# Altium project PCB_Project.PrjPcb (part 2 of 2)

## Sheet PART7_op_amp.SchDoc
size A4
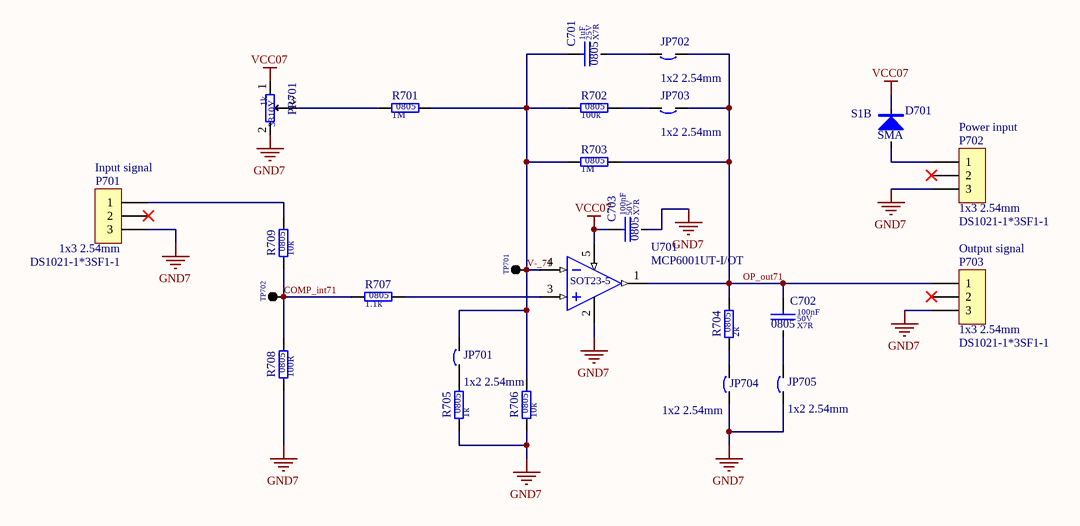
[diagram p7: PART7_op_amp.SchDoc]

### Parts
C701  value 1uF  Dielectric: X7R  Voltage: 25V  SCH_Footprint: 0805  [C_0805_2012]  (hidden comment: Ceramic X7R)
C702  value 100nF  Dielectric: X7R  Voltage: 50V  SCH_Footprint: 0805  [C_0805_2012]  (hidden comment: Ceramic X7R)
C703  value 100nF  Dielectric: X7R  Voltage: 50V  SCH_Footprint: 0805  [C_0805_2012]  (hidden comment: Ceramic X7R)
D701  value S1B  SCH_Footprint: SMA  [SMA_DO-214AC]
JP701  SCH_Footprint: 1x2 2.54mm  [P_HEADER_1x2_2.54]  (hidden comment: Goldpin)
JP702  SCH_Footprint: 1x2 2.54mm  [P_HEADER_1x2_2.54]  (hidden comment: Goldpin)
JP703  SCH_Footprint: 1x2 2.54mm  [P_HEADER_1x2_2.54]  (hidden comment: Goldpin)
JP704  SCH_Footprint: 1x2 2.54mm  [P_HEADER_1x2_2.54]  (hidden comment: Goldpin)
JP705  SCH_Footprint: 1x2 2.54mm  [P_HEADER_1x2_2.54]  (hidden comment: Goldpin)
P701  Input signal  value DS1021-1*3SF1-1  SCH_Footprint: 1x3 2.54mm  [P_HEADER_1x3_2.54]
P702  Power input  value DS1021-1*3SF1-1  SCH_Footprint: 1x3 2.54mm  [P_HEADER_1x3_2.54]
P703  Output signal  value DS1021-1*3SF1-1  SCH_Footprint: 1x3 2.54mm  [P_HEADER_1x3_2.54]
PR701  value 1k  [3310Y]  (hidden comment: Resistor)
R701  value 1M  SCH_Footprint: 0805  [R_0805_2012]  (hidden comment: Resistor)
R702  value 100k  SCH_Footprint: 0805  [R_0805_2012]  (hidden comment: Resistor)
R703  value 1M  SCH_Footprint: 0805  [R_0805_2012]  (hidden comment: Resistor)
R704  value 2k  SCH_Footprint: 0805  [R_0805_2012]  (hidden comment: Resistor)
R705  value 1k  SCH_Footprint: 0805  [R_0805_2012]  (hidden comment: Resistor)
R706  value 10k  SCH_Footprint: 0805  [R_0805_2012]  (hidden comment: Resistor)
R707  value 1.1k  SCH_Footprint: 0805  [R_0805_2012]  (hidden comment: Resistor)
R708  value 100R  SCH_Footprint: 0805  [R_0805_2012]  (hidden comment: Resistor)
R709  value 10k  SCH_Footprint: 0805  [R_0805_2012]  (hidden comment: Resistor)
TP701  Single pin  [TP_1PIN]  (value not drawn)
TP702  Single pin  [TP_1PIN]  (value not drawn)
U701  value MCP6001UT-I/OT  SCH_Footprint: SOT23-5  [SOT23-5_SC74A_SOT753_M]  (hidden comment: MCP6001UT-IOT)

### Nets
GND7: C703.2 JP704.1 JP705.1 P701.3 P702.3 P703.3 PR701.2 R705.1 R706.1 R708.1 U701.2(GND)
VCC07: C703.1 D701.1 PR701.1 U701.5(VDD)
COMP_int71: R707.1 R708.2 R709.1 TP702.1(TP)
OP_out71: C702.1 JP702.1 JP703.1 P703.1 R703.2 R704.2 U701.1(OUT)
V-_71: C701.1 JP701.2 R701.2 R702.1 R703.1 R706.2 TP701.1(TP) U701.4(IN-)
NetC701_2: C701.2 JP702.2
NetC702_2: C702.2 JP705.2
NetD701_2: D701.2 P702.1
NetJP701_1: JP701.1 R705.2
NetJP703_2: JP703.2 R702.2
NetJP704_2: JP704.2 R704.1
NetP701_1: P701.1 R709.2
NetPR701_3: PR701.3 R701.1
NetR707_2: R707.2 U701.3(IN+)

Not connected (* = marked no-connect by the designer): P701 2*; P702 2*; P703 2*

### Library data of the parts
C701 = C_1uF_25V_X7R_0805_10: Capacitor; Manufacturer: AVX; Manufacturer Part Number: 08053C105KAT2A; Tolerance (%): 10; Part Number: C_1uF_25V_X7R_0805_10; HelpURL: https://www.tme.eu/Document/667fe6e7748c0ed1675574c6bf64b751/AVX_X7R.pdf; Supplier 1: TME; Supplier Part Number 1: 08053C105KAT2A; Supplier 2: RS Components; Supplier Part Number 2: 1351396; Supplier 3: Farnell; Supplier Part Number 3: 1658877; Supplier 4: Mouser; Supplier Part Number 4: 581-08053C105KAT2A; Supplier 5: Digi-Key; Supplier Part Number 5: 478-5030-1-ND
C702 C703 = C_100nF_50V_X7R_0805_10: Capacitor; Manufacturer: AVX; Manufacturer Part Number: 08055C104K4T2A; Tolerance (%): 10; Part Number: C_100nF_50V_X7R_0805_10; HelpURL: http://www.tme.eu/pl/Document/943bdb20b23b898c4d4b2ec4eca4f2b6/cauto.pdf; Supplier 1: TME; Supplier Part Number 1: 08055C104K4T2A; Supplier 2: RS Components; Supplier 3: Farnell; Supplier 4: Mouser; Supplier 5: Digi-Key
D701 = D_S1B_1A_100V_SMA: Manufacturer: Vishay/General Semiconductor; Voltage: 100V; Current: 1A; Part Number: D_S1B_1A_100V_SMA; Manufacturer Part Number: S1B; Supplier 1: TME; Supplier 2: RS Components; Supplier 3: Farnell; Supplier 4: Mouser; Supplier Part Number 4: 821-S1B; Supplier 5: Digi-Key; Supplier Part Number 5: S1B/51GI
JP701-JP705 = CB_GOLDPIN: Circuit Breaker; Part Number: CB_GOLDPIN; Component Type: Standard; Supplier 1: TME; Supplier 2: RS Components; Supplier 3: Farnell; Supplier 4: Mouser; Supplier 5: Digi-Key
P701-P703 = P_HEADER_1x3_2.54: Pin Header; Manufacturer: Connfly; Part Number: P_HEADER_1x3_2.54; Component Type: Standard; HelpURL: http://www.tme.eu/en/Document/cc301e58a5da78cb543a94b5a5b7f06a/DS1021.pdf; Manufacturer Part Number: DS1021-1*3SF1-1; Supplier 1: TME; Supplier Part Number 1: ZL201-03G; Supplier 2: RS Components; Supplier 3: Farnell; Supplier 4: Mouser; Supplier 5: Digi-Key
PR701 = R_1k_3310Y_20: Manufacturer: Bourns; Manufacturer Part Number: 3310Y-001-102L; Voltage: 50V; Power: 250mW; Tolerance: 20%; SCH_Footprint: 3310Y; Part Number: R_1k_3310Y_20; HelpURL: https://docs.rs-online.com/4641/0900766b8069b9f0.pdf; Supplier 1: TME; Supplier Part Number 1: 3310Y-001-102L; Supplier 2: RS Components; Supplier Part Number 2: 522-0603P; Supplier 3: Farnell; Supplier Part Number 3: 1156139; Supplier 4: Mouser; Supplier Part Number 4: 652-3310Y-001-102L; Supplier 5: Digi-Key; Supplier Part Number 5: 3310Y-001-102L-ND
R701 R703 = R_1M_0805_1: Manufacturer: Yageo; Manufacturer Part Number: RC0805FR-071ML; Voltage: 150V; Power: 125mW; Tolerance: 1%; Part Number: R_1M_0805_1; HelpURL: https://pl.mouser.com/datasheet/2/447/PYu-RC_Group_51_RoHS_L_9-1314892.pdf; Supplier 1: TME; Supplier Part Number 1: RC0805FR-071M; Supplier 2: RS Components; Supplier Part Number 2: 618-3729; Supplier 3: Farnell; Supplier Part Number 3: 9237992; Supplier 4: Mouser; Supplier Part Number 4: 603-RC0805FR-071ML; Supplier 5: Digi-Key; Supplier Part Number 5: 311-1.00MCRCT-ND
R702 = R_100k_0805_1: Manufacturer: Yageo; Manufacturer Part Number: RC0805FR-07100KL; Voltage: 150V; Power: 125mW; Tolerance: 1%; Part Number: R_100k_0805_1; HelpURL: https://pl.mouser.com/datasheet/2/447/PYu-RC_Group_51_RoHS_L_9-1314892.pdf; Supplier 1: TME; Supplier Part Number 1: RC0805FR-07100K; Supplier 2: RS Components; Supplier 3: Farnell; Supplier Part Number 3: 9237879; Supplier 4: Mouser; Supplier Part Number 4: 603-RC0805FR-07100KL; Supplier 5: Digi-Key; Supplier Part Number 5: 311-100KCRCT-ND
R704 = R_2k_0805_1: Manufacturer: Royalohm; Manufacturer Part Number: HP05W3F2001T5E; Voltage: 150V; Power: 300mW; Tolerance: 1%; Part Number: R_2k_0805_1; HelpURL: https://www.tme.eu/pl/Document/fa390a0a31e891a154d3713216995c6e/HighPowerHP.pdf; Supplier 1: TME; Supplier Part Number 1: HP05-2K1%; Supplier 2: RS Components; Supplier 3: Farnell; Supplier 4: Mouser; Supplier 5: Digi-Key
R705 = R_1k_0805_1: Manufacturer: Royalohm; Manufacturer Part Number: HP05W3F1001T5E; Voltage: 150V; Power: 300mW; Tolerance: 1%; Part Number: R_1k_0805_1; HelpURL: https://www.tme.eu/pl/Document/63d5a2fbb689d2d511047d7cc8640cd8/chip_resistor_hp.pdf; Supplier 1: TME; Supplier Part Number 1: HP05-1K1%; Supplier 2: RS Components; Supplier 3: Farnell; Supplier 4: Mouser; Supplier 5: Digi-Key
R706 R709 = R_10k_0805_1: Manufacturer: Royalohm; Manufacturer Part Number: 0805S8F1002T5E; Voltage: 150V; Power: 125mW; Tolerance: 1%; Part Number: R_10k_0805_1; HelpURL: http://www.tme.eu/pl/Document/b315665a56acbc42df513c99b390ad98/ROYALOHM-THICKFILM.pdf; Supplier 1: TME; Supplier Part Number 1: SMD0805-10K-1%; Supplier 2: RS Components; Supplier 3: Farnell; Supplier 4: Mouser; Supplier 5: Digi-Key
R707 = R_1.1k_0805_1: Manufacturer: Yageo; Manufacturer Part Number: RC0805FR-071K1L; Voltage: 150V; Power: 125mW; Tolerance: 1%; Part Number: R_1.1k_0805_1; HelpURL: https://pl.mouser.com/datasheet/2/447/PYu-RC_Group_51_RoHS_L_9-1314892.pdf; Supplier 1: TME; Supplier Part Number 1: RC0805FR-071K1L; Supplier 2: RS Components; Supplier 3: Farnell; Supplier 4: Mouser; Supplier Part Number 4: 603-RC0805FR-071K1L; Supplier 5: Digi-Key; Supplier Part Number 5: 311-1.10KCRCT-ND
R708 = R_100R_0805_1: Manufacturer: Yageo; Manufacturer Part Number: RC0805FR-07100RL; Voltage: 150V; Power: 125mW; Tolerance: 1%; Part Number: R_100R_0805_1; HelpURL: https://www.tme.eu/pl/Document/7b8fed8c112f8a94930279c22c957f7f/rc0805yageo.pdf; Supplier 1: TME; Supplier Part Number 1: RC0805FR-07100R; Supplier 2: RS Components; Supplier Part Number 2: 618-5135; Supplier 3: Farnell; Supplier Part Number 3: 9237364; Supplier 4: Mouser; Supplier Part Number 4: 603-RC0805FR-07100RL; Supplier 5: Digi-Key; Supplier Part Number 5: 311-100CRCT-ND
TP701 TP702 = TP_1PIN: Testpoint; SCH_Footprint: Single; Part Number: TP_1PIN; Component Type: Standard; Supplier 1: TME; Supplier 2: RS Components; Supplier 3: Farnell; Supplier 4: Mouser; Supplier 5: Digi-Key
U701 = A_MCP6001UT-IOT: Manufacturer: Microchip; Part Number: A_MCP6001UT-IOT; HelpURL: https://datasheet.octopart.com/MCP6001UT-I/OT-Microchip-datasheet-8823409.pdf; Manufacturer Part Number: MCP6001UT-I/OT; Supplier 1: TME; Supplier 2: RS Components; Supplier 3: Farnell; Supplier 4: Mouser; Supplier 5: Digi-Key

## Sheet PART9_0_Volt_Protec_Simple.SchDoc
size A4
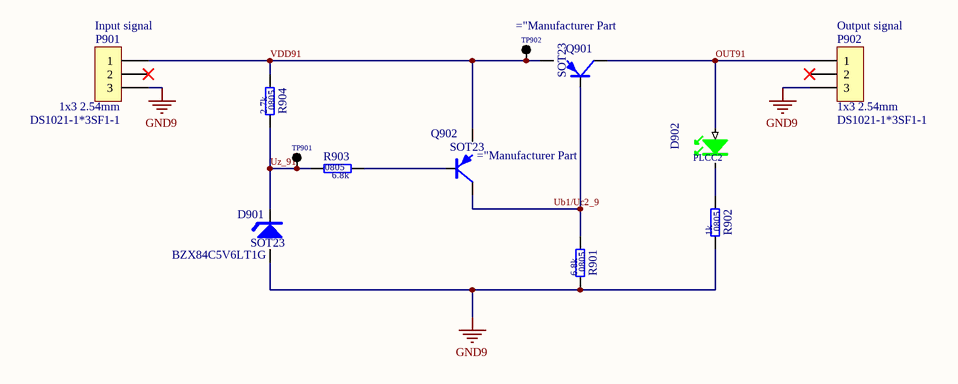
[diagram p8: PART9_0_Volt_Protec_Simple.SchDoc]

### Parts
D901  value BZX84C5V6LT1G  SCH_Footprint: SOT23  [D_SOT23_TO236_SC59]
D902  SCH_Footprint: PLCC2  [OL_PLCC2_3X2X13]
P901  Input signal  value DS1021-1*3SF1-1  SCH_Footprint: 1x3 2.54mm  [P_HEADER_1x3_2.54]
P902  Output signal  value DS1021-1*3SF1-1  SCH_Footprint: 1x3 2.54mm  [P_HEADER_1x3_2.54]
Q901  SCH_Footprint: SOT23  [SOT23_TO236_SC59]  (hidden comment: FMMT718)
Q902  SCH_Footprint: SOT23  [SOT23_TO236_SC59]  (hidden comment: FMMT718)
R901  value 6.8k  SCH_Footprint: 0805  [R_0805_2012]  (hidden comment: Resistor)
R902  value 1k  SCH_Footprint: 0805  [R_0805_2012]  (hidden comment: Resistor)
R903  value 6.8k  SCH_Footprint: 0805  [R_0805_2012]  (hidden comment: Resistor)
R904  value 2.7k  SCH_Footprint: 0805  [R_0805_2012]  (hidden comment: Resistor)
TP901  Single pin  [TP_1PIN]  (value not drawn)
TP902  Single pin  [TP_1PIN]  (value not drawn)

### Nets
GND9: D901.2(A) P901.3 P902.3 R901.1 R902.1
OUT91: D902.2(A) P902.1 Q901.3(C)
Ub1/Uc2_9: Q901.1(B) Q902.3(C) R901.2
Uz_91: D901.1(K) R903.2 R904.1 TP901.1(TP)
VDD91: P901.1 Q901.2(E) Q902.2(E) R904.2 TP902.1(TP)
NetD902_1: D902.1(K) R902.2
NetQ902_1: Q902.1(B) R903.1

Not connected (* = marked no-connect by the designer): P901 2*; P902 2*

### Library data of the parts
D901 = DZ_5V6_SOT23: Zener; Manufacturer: ON Semiconductor; Voltage: 5.6V; Part Number: DZ_5V6_SOT23; Manufacturer Part Number: BZX84C5V6LT1G; Supplier 1: TME; Supplier 2: RS Components; Supplier 3: Farnell; Supplier 4: Mouser; Supplier 5: Digi-Key; Supplier Part Number 5: BZX84C5V6LT1GOSCT-ND
D902 = OL_G_PLCC2: LED GREEN; Part Number: OL_G_PLCC2; Supplier 1: TME; Supplier 2: RS Components; Supplier 3: Farnell; Supplier 4: Mouser; Supplier Part Number 4: 720-LGT676P1Q224Z; Supplier 5: Digi-Key; Supplier Part Number 5: 475-1403-1-ND
P901 P902 = P_HEADER_1x3_2.54: Pin Header; Manufacturer: Connfly; Part Number: P_HEADER_1x3_2.54; Component Type: Standard; HelpURL: http://www.tme.eu/en/Document/cc301e58a5da78cb543a94b5a5b7f06a/DS1021.pdf; Manufacturer Part Number: DS1021-1*3SF1-1; Supplier 1: TME; Supplier Part Number 1: ZL201-03G; Supplier 2: RS Components; Supplier 3: Farnell; Supplier 4: Mouser; Supplier 5: Digi-Key
Q901 Q902 = QPN_FMMT718: Transitor PNP; Manufacturer: Diodes Inc; Voltage: 20V; Current: 1.5A; Value: ="Manufacturer Part; Part Number: QPN_FMMT718; Type: PNP; HelpURL: http://www.farnell.com/datasheets/1899058.pdf?_ga=2.225848856.322626374.1594719330-2144887534.1594719330&_gac=1.162002126.1594799133.Cj0KCQjw0rr4BRCtARIsAB0_48NV0jz3W19pAT9FbVDQVs_LlQ3yp5VjSJuwnIjxTn5Nizq0rEea5YcaAvzMEALw_wcB; Manufacturer Part Number: FMMT718; Supplier 1: TME; Supplier Part Number 1: FMMT718TA; Supplier 2: RS Components; Supplier Part Number 2: 154873; Supplier 3: Farnell; Supplier Part Number 3: 9526463; Supplier 4: Mouser; Supplier Part Number 4: 522-FMMT718TA; Supplier 5: Digi-Key; Supplier Part Number 5: FMMT718CT-ND
R901 R903 = R_6.8k_0805_1: Manufacturer: Royalohm; Manufacturer Part Number: HP05W3F6801T5E; Voltage: 150V; Power: 300mW; Tolerance: 1%; Part Number: R_6.8k_0805_1; HelpURL: https://www.tme.eu/pl/Document/fa390a0a31e891a154d3713216995c6e/HighPowerHP.pdf; Supplier 1: TME; Supplier Part Number 1: HP05-6K81%; Supplier 2: RS Components; Supplier 3: Farnell; Supplier 4: Mouser; Supplier 5: Digi-Key
R902 = R_1k_0805_1: as R705 on sheet PART7_op_amp; Part Number: R_1k_0805_1; HelpURL: https://www.tme.eu/pl/Document/63d5a2fbb689d2d511047d7cc8640cd8/chip_resistor_hp.pdf; Supplier 1: TME; Supplier Part Number 1: HP05-1K1%; Supplier 2: RS Components; Supplier 3: Farnell; Supplier 4: Mouser; Supplier 5: Digi-Key
R904 = R_2.7k_0805_1: Manufacturer: Royalohm; Manufacturer Part Number: HP05W3F2701T5E; Voltage: 150V; Power: 300mW; Tolerance: 1%; Part Number: R_2.7k_0805_1; HelpURL: https://www.tme.eu/pl/Document/fa390a0a31e891a154d3713216995c6e/HighPowerHP.pdf; Supplier 1: TME; Supplier Part Number 1: HP05-2K71%; Supplier 2: RS Components; Supplier 3: Farnell; Supplier 4: Mouser; Supplier 5: Digi-Key
TP901 TP902 = TP_1PIN: Testpoint; SCH_Footprint: Single; Part Number: TP_1PIN; Component Type: Standard; Supplier 1: TME; Supplier 2: RS Components; Supplier 3: Farnell; Supplier 4: Mouser; Supplier 5: Digi-Key

## Sheet PART10_Ast_Multivib_w_DC_DC_COnv.SchDoc
size A4
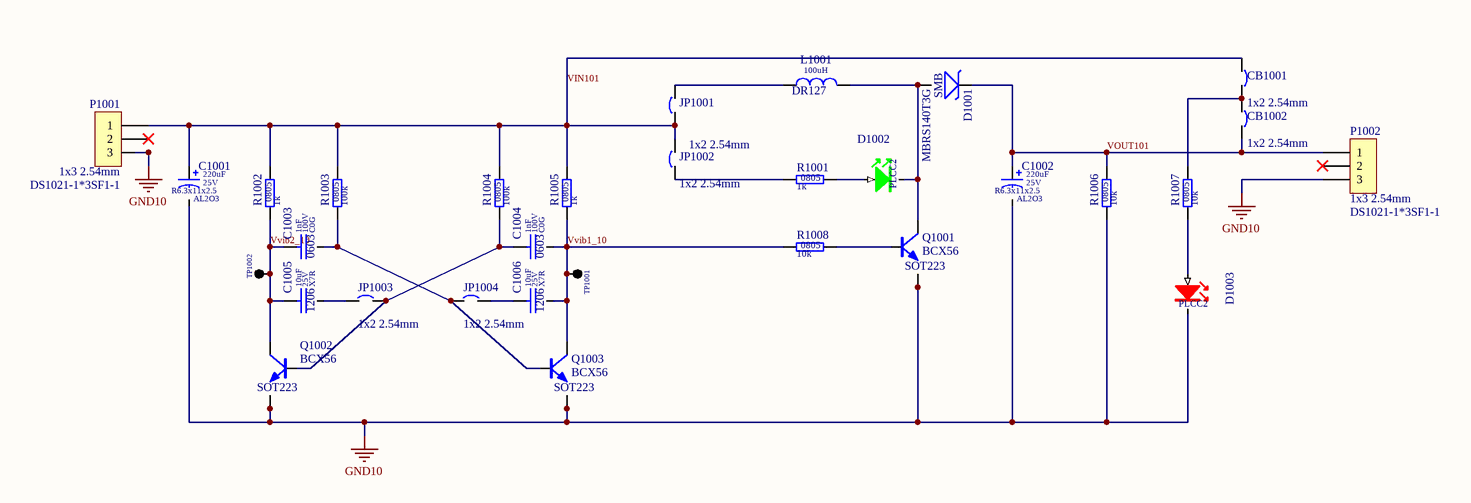
[diagram p9: PART10_Ast_Multivib_w_DC_DC_COnv.SchDoc]

### Parts
C1001  value 220uF  Dielectric: AL2O3  SCH_Footprint: R6.3x11x2.5  Voltage: 25V  [C_R6.3x11x2.5]  (hidden comment: Electrolytic Capacitor)
C1002  value 220uF  Dielectric: AL2O3  SCH_Footprint: R6.3x11x2.5  Voltage: 25V  [C_R6.3x11x2.5]  (hidden comment: Electrolytic Capacitor)
C1003  value 1nF  Dielectric: C0G  Voltage: 100V  SCH_Footprint: 0603  [C_0603_1608]  (hidden comment: Ceramic C0G)
C1004  value 1nF  Dielectric: C0G  Voltage: 100V  SCH_Footprint: 0603  [C_0603_1608]  (hidden comment: Ceramic C0G)
C1005  value 10uF  Dielectric: X7R  Voltage: 25V  SCH_Footprint: 1206  [C_1206_3216]  (hidden comment: Ceramic X7R)
C1006  value 10uF  Dielectric: X7R  Voltage: 25V  SCH_Footprint: 1206  [C_1206_3216]  (hidden comment: Ceramic X7R)
CB1001  SCH_Footprint: 1x2 2.54mm  [P_HEADER_1x2_2.54]  (hidden comment: Goldpin)
CB1002  SCH_Footprint: 1x2 2.54mm  [P_HEADER_1x2_2.54]  (hidden comment: Goldpin)
D1001  SCH_Footprint: SMB  [SMB_DO-214AA]  (hidden comment: MBRS140T3G)
D1002  SCH_Footprint: PLCC2  [OL_PLCC2_3X2X13]
D1003  SCH_Footprint: PLCC2  [OL_PLCC2_3X2X13]
JP1001  SCH_Footprint: 1x2 2.54mm  [P_HEADER_1x2_2.54]  (hidden comment: Goldpin)
JP1002  SCH_Footprint: 1x2 2.54mm  [P_HEADER_1x2_2.54]  (hidden comment: Goldpin)
JP1003  SCH_Footprint: 1x2 2.54mm  [P_HEADER_1x2_2.54]  (hidden comment: Goldpin)
JP1004  SCH_Footprint: 1x2 2.54mm  [P_HEADER_1x2_2.54]  (hidden comment: Goldpin)
L1001  value 100uH  SCH_Footprint: DR127  [L_DR127]  (hidden comment: Inductor)
P1001  value DS1021-1*3SF1-1  SCH_Footprint: 1x3 2.54mm  [P_HEADER_1x3_2.54]  (hidden comment: Goldpin)
P1002  value DS1021-1*3SF1-1  SCH_Footprint: 1x3 2.54mm  [P_HEADER_1x3_2.54]  (hidden comment: Goldpin)
Q1001  SCH_Footprint: SOT223  [SOT-223_M]  (hidden comment: BCX56)
Q1002  SCH_Footprint: SOT223  [SOT-223_M]  (hidden comment: BCX56)
Q1003  SCH_Footprint: SOT223  [SOT-223_M]  (hidden comment: BCX56)
R1001  value 1k  SCH_Footprint: 0805  [R_0805_2012]  (hidden comment: Resistor)
R1002  value 1k  SCH_Footprint: 0805  [R_0805_2012]  (hidden comment: Resistor)
R1003  value 100k  SCH_Footprint: 0805  [R_0805_2012]  (hidden comment: Resistor)
R1004  value 100k  SCH_Footprint: 0805  [R_0805_2012]  (hidden comment: Resistor)
R1005  value 1k  SCH_Footprint: 0805  [R_0805_2012]  (hidden comment: Resistor)
R1006  value 10k  SCH_Footprint: 0805  [R_0805_2012]  (hidden comment: Resistor)
R1007  value 10k  SCH_Footprint: 0805  [R_0805_2012]  (hidden comment: Resistor)
R1008  value 10k  SCH_Footprint: 0805  [R_0805_2012]  (hidden comment: Resistor)
TP1001  Single pin  [TP_1PIN]  (value not drawn)
TP1002  Single pin  [TP_1PIN]  (value not drawn)

### Nets
GND10: C1001.2 C1002.2 D1003.1(K) P1001.3 P1002.3 Q1001.1(C) Q1001.3(E) Q1002.1(C) Q1002.3(E) Q1003.1(C) Q1003.3(E) R1006.1
VIN101: C1001.1 CB1001.1 JP1001.1 JP1002.2 P1001.1 R1002.2 R1003.2 R1004.2 R1005.2
VOUT101: C1002.1 CB1002.2 D1001.1 P1002.1 R1006.2
Vvib1_10: C1004.2 C1006.2 Q1003.2(C) R1005.1 R1008.1 TP1001.1(TP)
Vvib2_10: C1003.1 C1005.1 Q1002.2(C) R1002.1 TP1002.1(TP)
NetC1003_2: C1003.2 JP1004.1 Q1003.4(B) R1003.1
NetC1004_1: C1004.1 JP1003.2 Q1002.4(B) R1004.1
NetC1005_2: C1005.2 JP1003.1
NetC1006_1: C1006.1 JP1004.2
NetCB1001_2: CB1001.2 CB1002.1 R1007.2
NetD1001_2: D1001.2 D1002.1(K) L1001.2 Q1001.2(C)
NetD1002_2: D1002.2(A) R1001.2
NetD1003_2: D1003.2(A) R1007.1
NetJP1001_2: JP1001.2 L1001.1
NetJP1002_1: JP1002.1 R1001.1
NetQ1001_4: Q1001.4(B) R1008.2

Not connected (* = marked no-connect by the designer): P1001 2*; P1002 2*

### Library data of the parts
C1001 C1002 = CE_220uF_25V_6.3x11x2.5_LESR_20: Polarized Capacitor; Manufacturer: Samxon; Manufacturer Part Number: GF 220U/25V; Tolerance (%): 20; Part Number: CE_220uF_25V_6.3x11x2.5_LESR_20; HelpURL: http://www.tme.eu/pl/Document/9fe41abe6e7b7973ea4089f212d099cc/E-GF_series.pdf; Supplier 1: TME; Supplier Part Number 1: GF220/25; Supplier 2: RS Components; Supplier 3: Farnell; Supplier 4: Mouser; Supplier 5: Digi-Key
C1003 C1004 = C_1nF_100V_C0G_0603_5: Capacitor; Manufacturer: Murata; Manufacturer Part Number: GRM1885C2A102JA01D; Tolerance (%): 5; Part Number: C_1nF_100V_C0G_0603_5; HelpURL: https://www.murata.com/~/media/webrenewal/support/library/catalog/products/capacitor/mlcc/c02e.ashx; Supplier 1: TME; Supplier Part Number 1: GRM1885C2A102JA01D; Supplier 2: RS Components; Supplier Part Number 2: 7235972; Supplier 3: Farnell; Supplier Part Number 3: 2494226; Supplier 4: Mouser; Supplier Part Number 4: 81-GRM1885C2A102JA01; Supplier 5: Digi-Key; Supplier Part Number 5: 490-3281-1-ND
C1005 C1006 = C_10uF_25V_X7R_1206_10: Capacitor; Manufacturer: Samsung Electro-Mechanics; Manufacturer Part Number: CL31B106KAHNNNE; Tolerance (%): 10; Part Number: C_10uF_25V_X7R_1206_10; HelpURL: http://www.tme.eu/pl/Document/4a42202b32dab16128fe107dd69598cc/samsung-chip-cap.pdf; Supplier 1: TME; Supplier Part Number 1: CL31B106KAHNNNE; Supplier 2: RS Components; Supplier 3: Farnell; Supplier 4: Mouser; Supplier 5: Digi-Key
CB1001 CB1002 JP1001-JP1004 = CB_GOLDPIN: Circuit Breaker; Part Number: CB_GOLDPIN; Component Type: Standard; Supplier 1: TME; Supplier 2: RS Components; Supplier 3: Farnell; Supplier 4: Mouser; Supplier 5: Digi-Key
D1001 = DS_MBRS140T3G_1A_40V_SMB: Manufacturer: ON Semiconductor; Voltage: 40V; Current: 1A; Value: MBRS140T3G; Part Number: DS_MBRS140T3G_1A_40V_SMB; Manufacturer Part Number: MBRS140T3G; Supplier 1: TME; Supplier 2: RS Components; Supplier 3: Farnell; Supplier 4: Mouser; Supplier 5: Digi-Key; Supplier Part Number 5: MBRS140T3GOSCT-ND
D1002 = OL_G_PLCC2: LED GREEN; Part Number: OL_G_PLCC2; Supplier 1: TME; Supplier 2: RS Components; Supplier 3: Farnell; Supplier 4: Mouser; Supplier Part Number 4: 720-LGT676P1Q224Z; Supplier 5: Digi-Key; Supplier Part Number 5: 475-1403-1-ND
D1003 = OL_R_PLCC2: LED_RED; Part Number: OL_R_PLCC2; Supplier 1: TME; Supplier 2: RS Components; Supplier 3: Farnell; Supplier 4: Mouser; Supplier Part Number 4: 720-LST676-R1S1-1-Z; Supplier 5: Digi-Key; Supplier Part Number 5: 475-2683-1-ND
L1001 = L_100uH_1.96A_DR127: Induction; Manufacturer: Eaton; Manufacturer Part Number: DR127-101-R; Current: 1.96A; Resistance: 163mR; Part Number: L_100uH_1.96A_DR127; HelpURL: https://datasheet.octopart.com/DR127-101-R-Eaton-datasheet-552538.pdf; Supplier 1: TME; Supplier 2: RS Components; Supplier Part Number 2: 7701003; Supplier 3: Farnell; Supplier Part Number 3: 1463472; Supplier 4: Mouser; Supplier Part Number 4: 704-DR127-101-R; Supplier 5: Digi-Key; Supplier Part Number 5: 513-1038-1-ND
P1001 P1002 = P_HEADER_1x3_2.54: Pin Header; Manufacturer: Connfly; Part Number: P_HEADER_1x3_2.54; Component Type: Standard; HelpURL: http://www.tme.eu/en/Document/cc301e58a5da78cb543a94b5a5b7f06a/DS1021.pdf; Manufacturer Part Number: DS1021-1*3SF1-1; Supplier 1: TME; Supplier Part Number 1: ZL201-03G; Supplier 2: RS Components; Supplier 3: Farnell; Supplier 4: Mouser; Supplier 5: Digi-Key
Q1001-Q1003 = QNP_BCX56: Manufacturer: Nexperia; Type: NPN; Voltage: 80V; Current: 1A; Part Number: QNP_BCX56; Value: BCX56; HelpURL: https://datasheet.octopart.com/BCX56-10%2C115-Nexperia-datasheet-78799842.pdf; Manufacturer Part Number: BCX56; Supplier 1: TME; Supplier 2: RS Components; Supplier Part Number 2: 725-8540; Supplier 3: Farnell; Supplier Part Number 3: 1757914; Supplier 4: Mouser; Supplier Part Number 4: 771-BCX56-10-T/R; Supplier 5: Digi-Key; Supplier Part Number 5: 1727-4318-1-ND-ND
R1001 R1002 R1005 = R_1k_0805_1: as R705 on sheet PART7_op_amp; Part Number: R_1k_0805_1; HelpURL: https://www.tme.eu/pl/Document/63d5a2fbb689d2d511047d7cc8640cd8/chip_resistor_hp.pdf; Supplier 1: TME; Supplier Part Number 1: HP05-1K1%; Supplier 2: RS Components; Supplier 3: Farnell; Supplier 4: Mouser; Supplier 5: Digi-Key
R1003 R1004 = R_100k_0805_1: as R702 on sheet PART7_op_amp; Part Number: R_100k_0805_1; HelpURL: https://pl.mouser.com/datasheet/2/447/PYu-RC_Group_51_RoHS_L_9-1314892.pdf; Supplier 1: TME; Supplier Part Number 1: RC0805FR-07100K; Supplier 2: RS Components; Supplier 3: Farnell; Supplier Part Number 3: 9237879; Supplier 4: Mouser; Supplier Part Number 4: 603-RC0805FR-07100KL; Supplier 5: Digi-Key; Supplier Part Number 5: 311-100KCRCT-ND
R1006-R1008 = R_10k_0805_1: as R706 on sheet PART7_op_amp; Part Number: R_10k_0805_1; HelpURL: http://www.tme.eu/pl/Document/b315665a56acbc42df513c99b390ad98/ROYALOHM-THICKFILM.pdf; Supplier 1: TME; Supplier Part Number 1: SMD0805-10K-1%; Supplier 2: RS Components; Supplier 3: Farnell; Supplier 4: Mouser; Supplier 5: Digi-Key
TP1001 TP1002 = TP_1PIN: Testpoint; SCH_Footprint: Single; Part Number: TP_1PIN; Component Type: Standard; Supplier 1: TME; Supplier 2: RS Components; Supplier 3: Farnell; Supplier 4: Mouser; Supplier 5: Digi-Key

## Sheet PART11_Rectifier.SchDoc
size A4
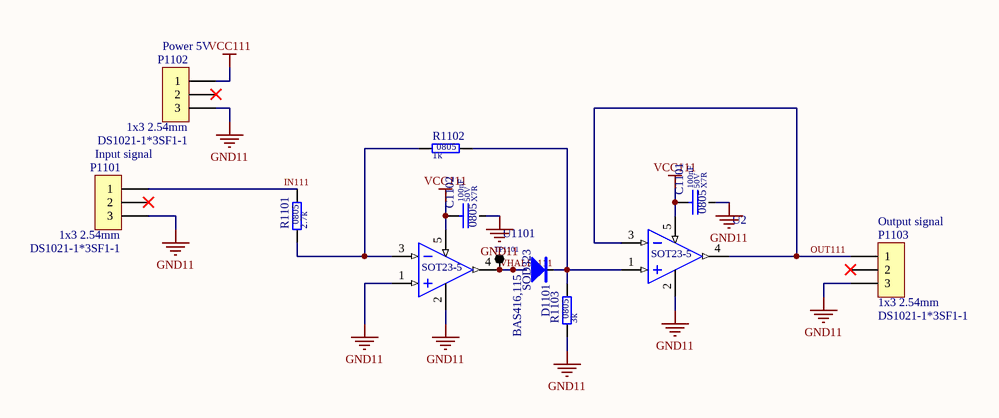
[diagram p10: PART11_Rectifier.SchDoc]

### Parts
C1101  value 100nF  Dielectric: X7R  Voltage: 50V  SCH_Footprint: 0805  [C_0805_2012]  (hidden comment: Ceramic X7R)
C1102  value 100nF  Dielectric: X7R  Voltage: 50V  SCH_Footprint: 0805  [C_0805_2012]  (hidden comment: Ceramic X7R)
D1101  value BAS416,115  [SOD323]  (hidden comment: BAS416)
P1101  Input signal  value DS1021-1*3SF1-1  SCH_Footprint: 1x3 2.54mm  [P_HEADER_1x3_2.54]
P1102  Power 5V  value DS1021-1*3SF1-1  SCH_Footprint: 1x3 2.54mm  [P_HEADER_1x3_2.54]
P1103  Output signal  value DS1021-1*3SF1-1  SCH_Footprint: 1x3 2.54mm  [P_HEADER_1x3_2.54]
R1101  value 2.7k  SCH_Footprint: 0805  [R_0805_2012]  (hidden comment: Resistor)
R1102  value 1k  SCH_Footprint: 0805  [R_0805_2012]  (hidden comment: Resistor)
R1103  value 3k  SCH_Footprint: 0805  [R_0805_2012]  (hidden comment: Resistor)
TP1101  Single pin  [TP_1PIN]  (value not drawn)
U2  SCH_Footprint: SOT23-5  [SOT23-5_SC74A_SOT753_M]  (hidden comment: LM321)
U1101  SCH_Footprint: SOT23-5  [SOT23-5_SC74A_SOT753_M]  (hidden comment: LM321)

### Nets
GND11: C1101.2 C1102.2 P1101.3 P1102.3 P1103.3 R1103.1 U2.2(GND) U1101.1(IN+) U1101.2(GND)
VCC111: C1101.1 C1102.1 P1102.1 U2.5(VDD) U1101.5(VDD)
IN111: P1101.1 R1101.2
OUT111: P1103.1 U2.3(IN-) U2.4(OUT)
VHALF_111: D1101.2 TP1101.1(TP) U1101.4(OUT)
NetD1101_1: D1101.1 R1102.2 R1103.2 U2.1(IN+)
NetR1101_1: R1101.1 R1102.1 U1101.3(IN-)

Not connected (* = marked no-connect by the designer): P1101 2*; P1102 2*; P1103 2*

### Library data of the parts
C1101 C1102 = C_100nF_50V_X7R_0805_10: as C702 on sheet PART7_op_amp; Part Number: C_100nF_50V_X7R_0805_10; HelpURL: http://www.tme.eu/pl/Document/943bdb20b23b898c4d4b2ec4eca4f2b6/cauto.pdf; Supplier 1: TME; Supplier Part Number 1: 08055C104K4T2A; Supplier 2: RS Components; Supplier 3: Farnell; Supplier 4: Mouser; Supplier 5: Digi-Key
D1101 = D_BAS416_0A5_75V_SOD323: Manufacturer: Nexperia; Voltage: 75V; Current: 0.5A; SCH_Footprint: SOD323; Part Number: D_BAS416_0A5_75V_SOD323; HelpURL: https://assets.nexperia.com/documents/data-sheet/BAS416.pdf; Manufacturer Part Number: BAS416,115; Supplier 1: TME; Supplier Part Number 1: BAS416.115; Supplier 2: RS Components; Supplier Part Number 2: 508-286; Supplier 3: Farnell; Supplier Part Number 3: 2319285; Supplier 4: Mouser; Supplier Part Number 4: 771-BAS416-T/R; Supplier 5: Digi-Key; Supplier Part Number 5: 1727-4807-1-ND
P1101-P1103 = P_HEADER_1x3_2.54: Pin Header; Manufacturer: Connfly; Part Number: P_HEADER_1x3_2.54; Component Type: Standard; HelpURL: http://www.tme.eu/en/Document/cc301e58a5da78cb543a94b5a5b7f06a/DS1021.pdf; Manufacturer Part Number: DS1021-1*3SF1-1; Supplier 1: TME; Supplier Part Number 1: ZL201-03G; Supplier 2: RS Components; Supplier 3: Farnell; Supplier 4: Mouser; Supplier 5: Digi-Key
R1101 = R_2.7k_0805_1: as R904 on sheet PART9_0_Volt_Protec_Simple; Part Number: R_2.7k_0805_1; HelpURL: https://www.tme.eu/pl/Document/fa390a0a31e891a154d3713216995c6e/HighPowerHP.pdf; Supplier 1: TME; Supplier Part Number 1: HP05-2K71%; Supplier 2: RS Components; Supplier 3: Farnell; Supplier 4: Mouser; Supplier 5: Digi-Key
R1102 = R_1k_0805_1: as R705 on sheet PART7_op_amp; Part Number: R_1k_0805_1; HelpURL: https://www.tme.eu/pl/Document/63d5a2fbb689d2d511047d7cc8640cd8/chip_resistor_hp.pdf; Supplier 1: TME; Supplier Part Number 1: HP05-1K1%; Supplier 2: RS Components; Supplier 3: Farnell; Supplier 4: Mouser; Supplier 5: Digi-Key
R1103 = R_3k_0805_1: Manufacturer: Royalohm; Manufacturer Part Number: HP05W3F3001T5E; Voltage: 150V; Power: 300mW; Tolerance: 1%; Part Number: R_3k_0805_1; HelpURL: https://www.tme.eu/pl/Document/fa390a0a31e891a154d3713216995c6e/HighPowerHP.pdf; Supplier 1: TME; Supplier Part Number 1: HP05-3K1%; Supplier 2: RS Components; Supplier 3: Farnell; Supplier 4: Mouser; Supplier 5: Digi-Key
TP1101 = TP_1PIN: Testpoint; SCH_Footprint: Single; Part Number: TP_1PIN; Component Type: Standard; Supplier 1: TME; Supplier 2: RS Components; Supplier 3: Farnell; Supplier 4: Mouser; Supplier 5: Digi-Key
U2 U1101 = A_LM321: Part Number: A_LM321; HelpURL: http://www.ti.com/lit/ds/symlink/lm321.pdf; Supplier 1: TME; Supplier 2: RS Components; Supplier 3: Farnell; Supplier 4: Mouser; Supplier Part Number 4: 926-LM321MFX/NOPB; Supplier 5: Digi-Key; Supplier Part Number 5: LM321MF/NOPBCT-ND

## Sheet GND.SchDoc
size A4
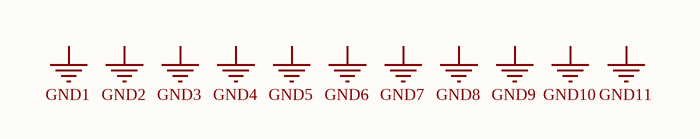
[diagram p11: GND.SchDoc]

### Notes on the sheet
- Labels drawn without touching a wire or pin: GND1, GND2, GND3, GND4, GND5, GND6, GND7, GND8, GND9, GND10, GND11